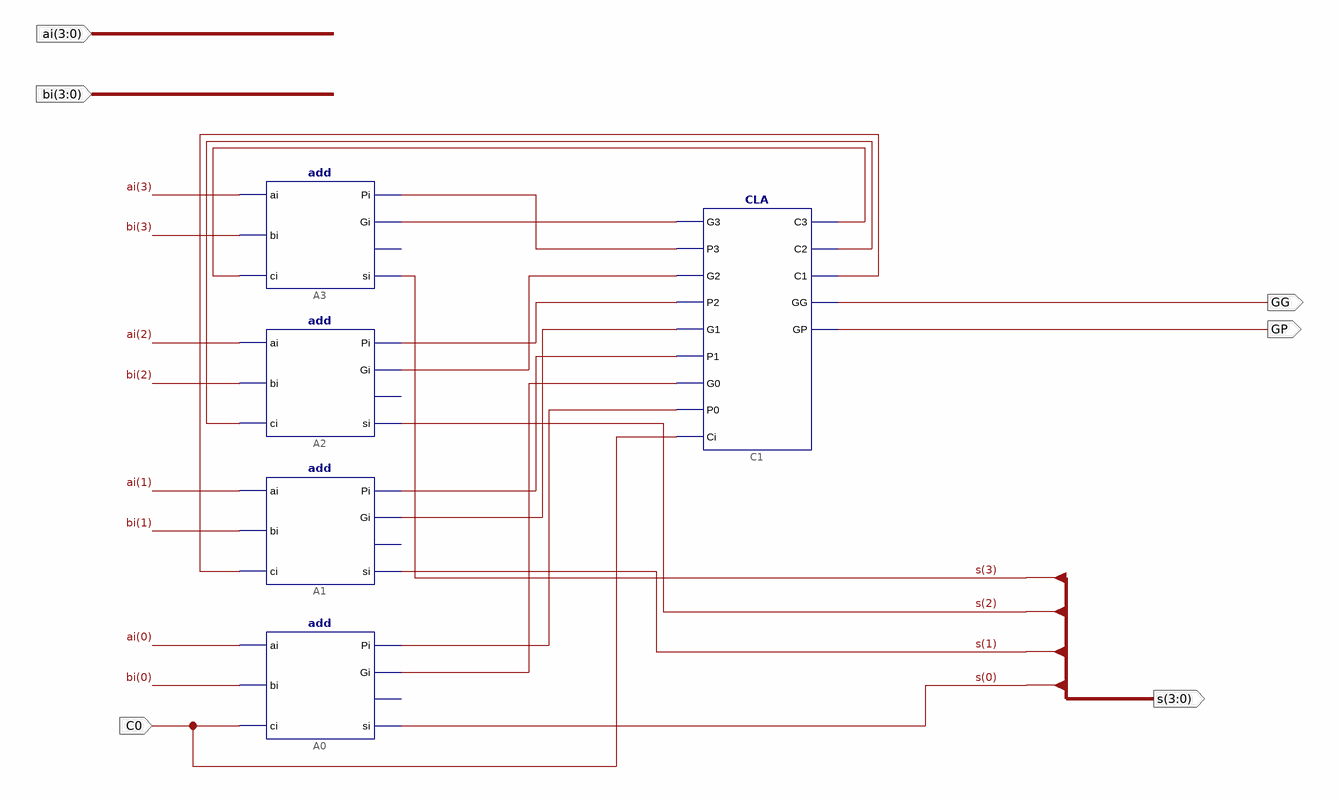
[diagram p0: schematic sheet 1]
// Xilinx ISE schematic ADD4b.sch (kintex7) as structural Verilog: 5 symbols, 6 ports
module ADD4b (
  input  [3:0] ai,
  input  [3:0] bi,
  input  C0,
  output GG,
  output GP,
  output [3:0] s
);

  wire XLXN_5, XLXN_9, XLXN_12, XLXN_16, XLXN_17, XLXN_18, XLXN_19, XLXN_20, XLXN_21, XLXN_22, XLXN_23;

  add A3 (.ai(ai[3]), .bi(bi[3]), .ci(XLXN_5), .Pi(XLXN_17), .Gi(XLXN_16), .si(s[3]));  // open: co
  add A2 (.ai(ai[2]), .bi(bi[2]), .ci(XLXN_9), .Pi(XLXN_18), .Gi(XLXN_19), .si(s[2]));  // open: co
  add A1 (.ai(ai[1]), .bi(bi[1]), .ci(XLXN_12), .Pi(XLXN_21), .Gi(XLXN_20), .si(s[1]));  // open: co
  add A0 (.ai(ai[0]), .bi(bi[0]), .ci(C0), .Pi(XLXN_22), .Gi(XLXN_23), .si(s[0]));  // open: co
  CLA C1 (
    .C1(XLXN_12), .C2(XLXN_9), .C3(XLXN_5), .Ci(C0), .G0(XLXN_23), .G1(XLXN_20), .G2(XLXN_19), .G3(XLXN_16),
    .GG(GG), .GP(GP), .P0(XLXN_22), .P1(XLXN_21), .P2(XLXN_18), .P3(XLXN_17));
endmodule
